# EAGLE design PiezoPreamp_V5 (EAGLE 7.5.0)
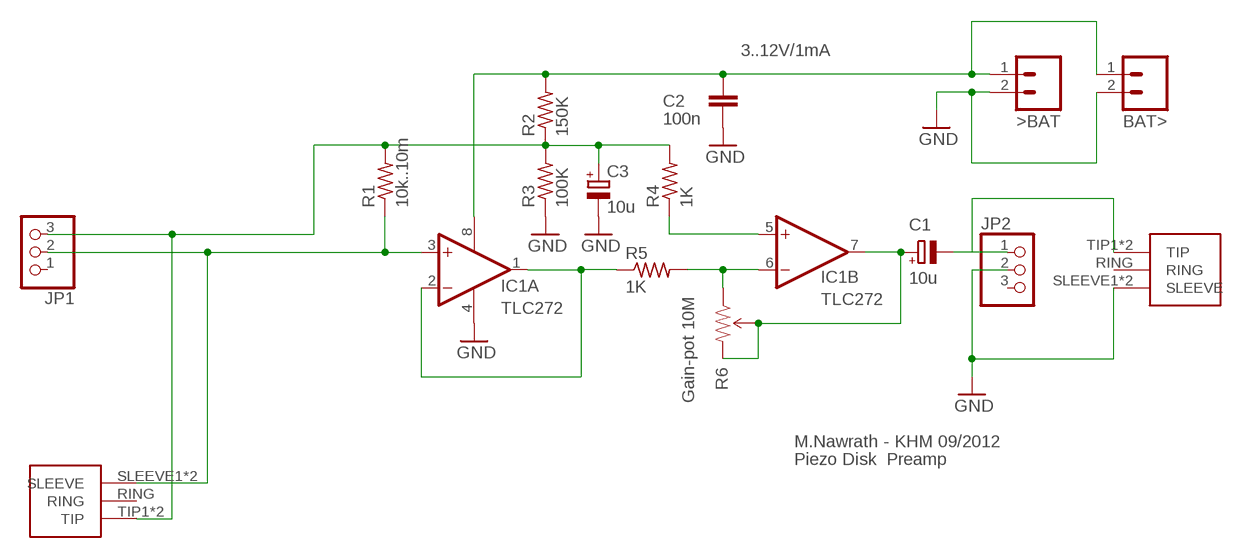
[diagram p0: schematic, sheet 1]

## Parts
>BAT  M02LOCK  [1X02_LOCK]
BAT>  M02LOCK  [1X02_LOCK]
C1  10u  CPOL-EUE2.5-5  [E2,5-5]
C2  100n  C-EU025-025X050  [C025-025X050]
C3  10u  CPOL-EUE2.5-5  [E2,5-5]
IC1  TLC272  TLC272P  [DIL08]
JP1  PINHD-1X3  [1X03]
JP2  PINHD-1X3  [1X03]
OUT1-TRS  1/8"-F-STEREO-PCB  [1/8"-F-STEREO-PCB]
R1  10k..10m  R-US_0204/2V  [0204V]
R2  150K  R-US_0204/2V  [0204V]
R3  100K  R-US_0204/2V  [0204V]
R4  1K  R-US_0204/2V  [0204V]
R5  1K  R-US_0204/2V  [0204V]
R6  Gain-pot 10M  TRIMPOT-PTH-KNOB  [3386U]
U$2  1/8"-F-STEREO-PCB  [1/8"-F-STEREO-PCB]

## Nets
GND: >BAT.2 BAT>.2 C2.1 C3.- IC1.4(P:V-) JP2.2 OUT1-TRS.SLEEVE1(SLEEVE) OUT1-TRS.SLEEVE2(SLEEVE) R3.1
N$1: C3.+ JP1.3 R1.2 R2.1 R3.2 R4.2 U$2.TIP1(TIP) U$2.TIP2(TIP)
N$2: IC1.6(B:-IN) R5.2 R6.1(CCW)
N$5: IC1.5(B:+IN) R4.1
N$6: C1.+ IC1.7(B:OUT) R6.2(WIPER) R6.3(CW)
N$8: IC1.3(A:+IN) JP1.2 R1.1 U$2.SLEEVE1(SLEEVE) U$2.SLEEVE2(SLEEVE)
N$14: IC1.1(A:OUT) IC1.2(A:-IN) R5.1
OUT1: C1.- JP2.1 OUT1-TRS.TIP1(TIP) OUT1-TRS.TIP2(TIP)
V9V: >BAT.1 BAT>.1 C2.2 IC1.8(P:V+) R2.2
Unconnected: JP1.1 JP2.3 OUT1-TRS.RING U$2.RING

## Notes on the sheet
- 3..12V/1mA
- M.Nawrath - KHM 09/2012
- Piezo Disk  Preamp

## Library data of the parts
>BAT BAT> = SparkFun-Connectors:M02: Header 2 Standard 2-pin 0.1" header. Use with straight break away headers (SKU : PRT-00116), right angle break away headers (PRT-00553), swiss pins (PRT-00743), machine pins (PRT-00117), and female headers (PRT-00115). Molex polarized connector foot print use with SKU : PRT-08233 with associated crimp pins and housings.
C1 C3 = rcl:CPOL-EU: POLARIZED CAPACITOR, European symbol
C2 = rcl:C-EU: CAPACITOR, European symbol
IC1 = linear:TLC272: OP AMP
JP1 JP2 = adafruit:PINHD-1X3: PIN HEADER
OUT1-TRS U$2 = CMU-ArtFab:1/8"-F-STEREO-PCB
R1-R5 = resistor:R-US_: RESISTOR, American symbol
R6 = SparkFun-Electromechanical:TRIMPOT: Various small potentiometers for "set-and-forget" applications

## Board
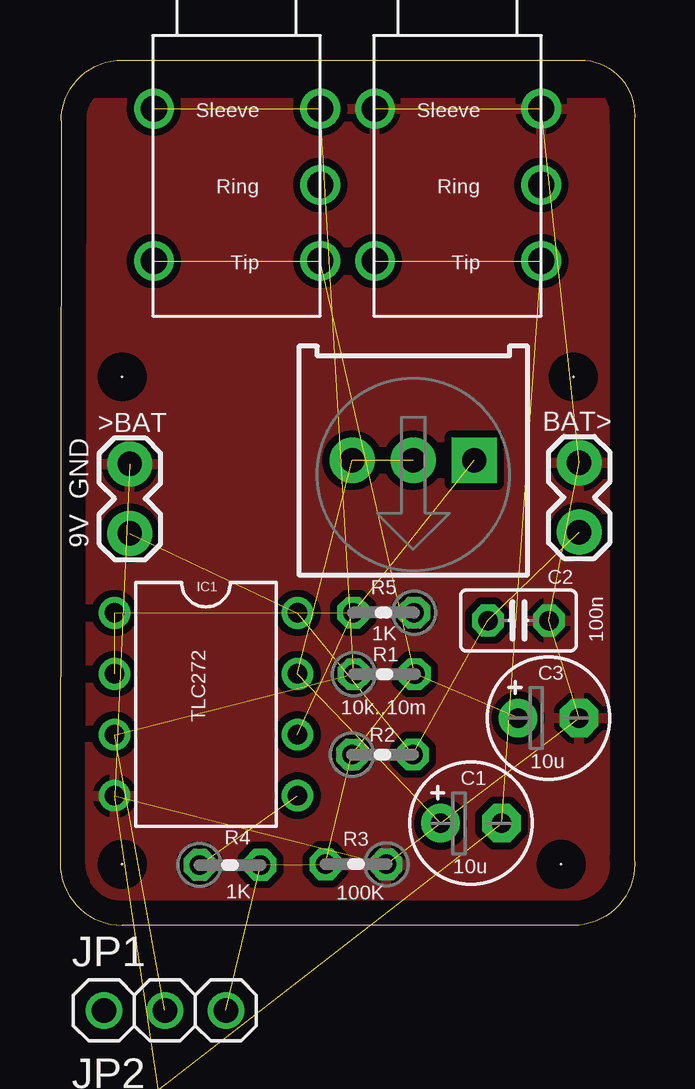
[diagram p1: board, top side]
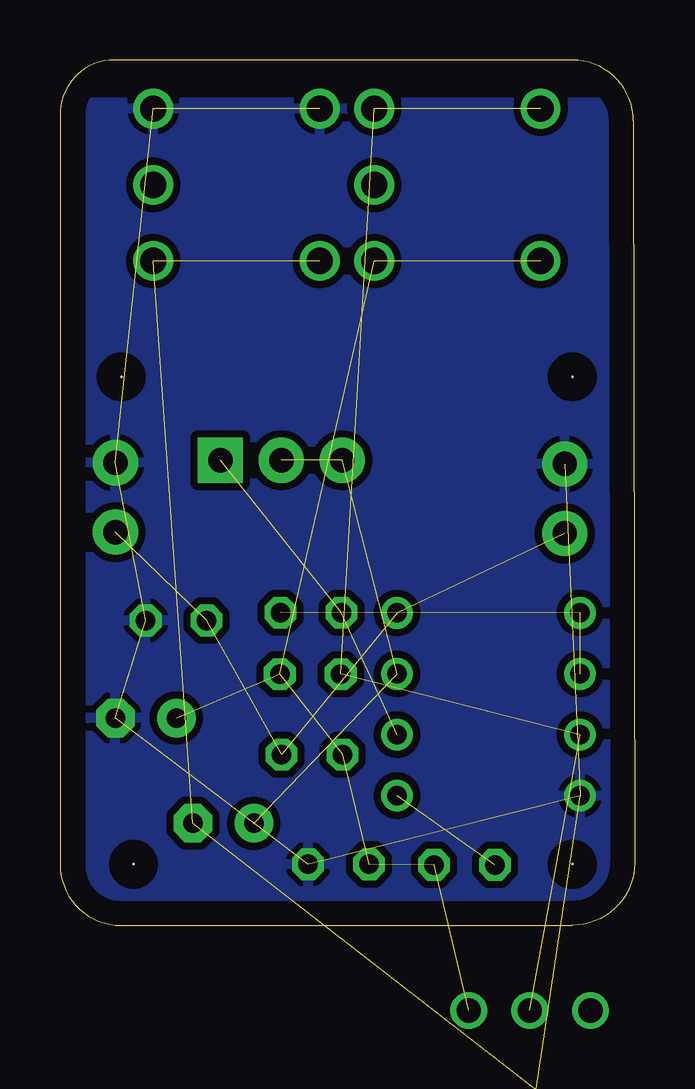
[diagram p2: board, bottom side, seen from below]

Size 23.94 x 36.07 mm. Coordinates in mm from the lower left corner, seen from the top.
Outline: 0.05,33.53 arc-90 2.59,36.07 21.89,36.07 arc-90 23.93,33.53 23.93,2.79 arc-90 21.64,0 2.59,0 arc-90 0,2.59 0.05,33.53
Copper layers (1*16): Top 0.035mm / dielectric 1.5mm / Bottom 0.035mm
Design rules "default": minimum track width 10mil, minimum drill 24mil, track to track 8mil, track to pad 8mil, pad to pad 8mil, via to via 8mil, smd to smd 8mil, copper to edge 40mil, drill to drill 8mil, minimum pad ring 10mil, minimum via ring 8mil, stop-mask expansion 4mil, vias tented up to drill 0mil, thermal gap 10mil
Holes 0 mm at 2.59,22.86 21.39,22.86 2.59,2.54 20.88,2.54

### Footprints (pad centres in the part's own frame; a part is rotated, then mirrored left to right if it is on the bottom)
1X02_LOCK = drill 1.016 pad 1.88: 1 -0.178,0; 2 2.718,0
E2,5-5 = drill 0.813 pad 1.6: + -1.27,0 | drill 0.813 pad 1.6 octagon: - 1.27,0
C025-025X050 = drill 0.813 octagon: 1 -1.27,0; 2 1.27,0
DIL08 = drill 0.813 pad 1.27: 1 -3.81,-3.81; 2 -1.27,-3.81; 3 1.27,-3.81; 4 3.81,-3.81; 5 3.81,3.81; 6 1.27,3.81; 7 -1.27,3.81; 8 -3.81,3.81
1X03 = drill 1.016: 1 -2.54,0; 2 0,0; 3 2.54,0
1/8"-F-STEREO-PCB = drill 1.1: RING 5.461,0; SLEEVE1 8.636,6.934; SLEEVE2 8.636,0; TIP1 2.286,6.934; TIP2 2.286,0
0204V = drill 0.813 octagon: 1 -1.27,0; 2 1.27,0
3386U = drill 1.016 pad 1.88 square: 1 -2.54,-0.015 | drill 1.016 pad 1.88: 2 0,-0.015; 3 2.54,-0.015

### Placement (x,y rotation side)
>BAT  2.91,16.51 90 top
BAT>  21.63,16.56 90 top
C1  17.13,4.25 0 top
C2  19.1,12.7 180 top
C3  20.36,8.64 0 top
IC1  6.08,9.21 270 top
JP1  4.37,-3.56 0 top  (outside the outline)
JP2  4.37,-8.64 0 top  (outside the outline)
OUT1-TRS  20.05,25.4 90 top
R1  13.51,10.46 0 top
R2  13.44,7.11 0 top
R3  12.33,2.54 180 top
R4  7.09,2.51 0 top
R5  13.49,13.03 180 top
R6  14.72,19.37 180 top
U$2  10.85,25.4 90 top

### Tracks (layer width: path | path; a pad name or v marks a point on that pad's centre or on a via)
GND  (8 unrouted)
  pour Bottom (isolate 0.305): 1,34.29 22.91,34.29 22.72,0.95 1.08,0.95
  pour Top (isolate 0.305): 1,34.29 22.91,34.29 22.72,0.95 1,1.05
N$1  (7 unrouted)
N$2  (2 unrouted)
N$5  (1 unrouted)
N$6  (3 unrouted)
N$8  (4 unrouted)
N$14  (2 unrouted)
OUT1  (3 unrouted)
V9V  (4 unrouted)

### Text on the board
tNames: GND | 9V